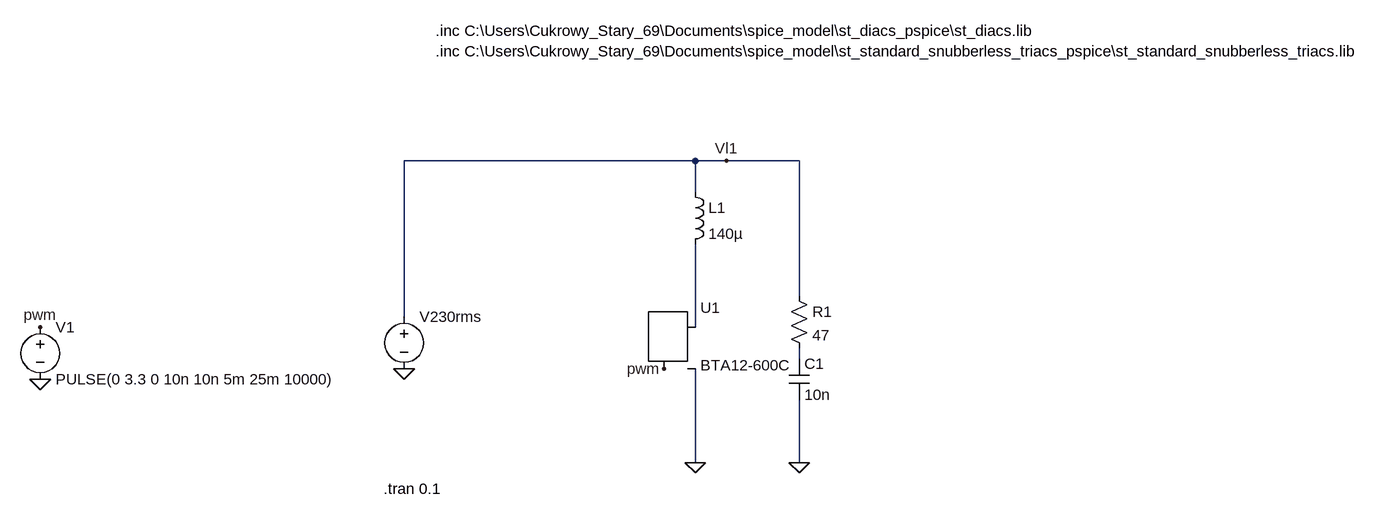
[diagram p0: schematic SSR_symulacja.asc]
SSR_symulacja.asc, the LTspice schematic file:
Version 4
SHEET 1 880 680
WIRE -496 -80 -944 -80
WIRE -448 -80 -496 -80
WIRE -336 -80 -448 -80
WIRE -496 -32 -496 -80
WIRE -336 128 -336 -80
WIRE -944 160 -944 -80
WIRE -496 176 -496 48
WIRE -336 224 -336 208
WIRE -496 384 -496 240
WIRE -336 384 -336 288
FLAG -944 240 0
FLAG -336 384 0
FLAG -496 384 0
FLAG -1504 256 0
FLAG -1504 176 pwm
FLAG -448 -80 Vl1
FLAG -544 240 pwm
SYMBOL ind -512 -48 R0
SYMATTR InstName L1
SYMATTR Value 140µ
SYMATTR SpiceLine Rser=25
SYMBOL voltage -944 144 R0
WINDOW 3 24 96 Invisible 2
WINDOW 123 0 0 Left 0
WINDOW 39 0 0 Left 0
SYMATTR Value SINE(0 320 50)
SYMATTR InstName V230rms
SYMBOL Misc\\TRIAC -528 176 R0
SYMATTR InstName U1
SYMATTR Value BTA12-600C
SYMBOL res -352 112 R0
SYMATTR InstName R1
SYMATTR Value 47
SYMBOL cap -352 224 R0
SYMATTR InstName C1
SYMATTR Value 10n
SYMBOL voltage -1504 160 R0
WINDOW 123 0 0 Left 0
WINDOW 39 0 0 Left 0
SYMATTR InstName V1
SYMATTR Value PULSE(0 3.3 0 10n 10n 5m 25m 10000)
TEXT -976 424 Left 2 !.tran 0.1
TEXT -896 -280 Left 2 !.inc C:\\Users\\Cukrowy_Stary_69\\Documents\\spice_model\\st_diacs_pspice\\st_diacs.lib\n.inc C:\\Users\\Cukrowy_Stary_69\\Documents\\spice_model\\st_standard_snubberless_triacs_pspice\\st_standard_snubberless_triacs.lib

The netlist it stands for:
* SSR_symulacja.asc
L1 Vl1 N001 140µ Rser=25
V230rms Vl1 0 SINE(0 320 50)
XU1 N001 pwm 0 BTA12-600C  ; pins MT2 G MT1
R1 Vl1 N002 47
C1 N002 0 10n
V1 pwm 0 PULSE(0 3.3 0 10n 10n 5m 25m 10000)
.tran 0.1
.inc C:\Users\Cukrowy_Stary_69\Documents\spice_model\st_diacs_pspice\st_diacs.lib
.inc C:\Users\Cukrowy_Stary_69\Documents\spice_model\st_standard_snubberless_triacs_pspice\st_standard_snubberless_triacs.lib
.backanno
.end